# Altium project Node.PrjPCB (part 3 of 3)
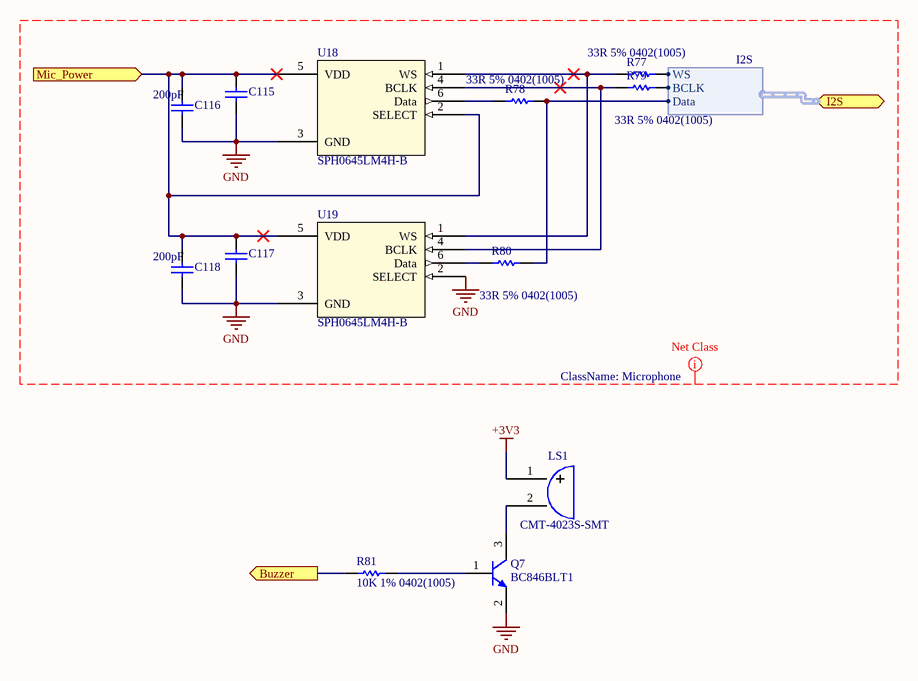
[diagram p11: Audio.SchDoc]

## Nets that join several sheets
+3V3: NFC (U40.16 U40.18), Interface (18 pins), LevelShifter (Q5.1 Q6.1 R72.2 R74.2), IR (11 pins), LEDs (21 pins), Power (FB1.2), RF (16 pins), uC (20 pins), Sensors (26 pins), Audio (LS1.1)
+5: NFC (C93.2 C94.2 U40.2), Interface (5 pins), LevelShifter (R73.2 R75.2), Power (C16.2 FB2.1 U6.14)
GND: NFC (30 pins), Interface (51 pins), IR (23 pins), LEDs (21 pins), Power (38 pins), RF (30 pins), uC (28 pins), Sensors (24 pins), Audio (8 pins)
VBUS: Interface (C4.1 F2.2 U3.31 U4.6), Power (Q4.3 R42.2)
VBUS2: Interface (F1.2 U1.6), Power (Q2.3 R26.2), uC (U17.M4)
VExt: Interface (P11.1), Power (Q3.3 R31.2)
VOut: IR (U8#1.4), Power (16 pins)
16U2 RX: Interface (U3.8), LevelShifter (Q6.3 R75.1)
16U2 TX: Interface (U3.9), LevelShifter (Q5.3 R73.1)
CE: Power (U5.17), uC (U17.L6)
MISO: NFC (U40.23), Interface (J4.7), uC (U17.B12)
MOSI: NFC (U40.24), Interface (J4.3), uC (U17.B11)
NetC7_2: Interface (C7.2), uC (U17.B3)
NetC12_1: Interface (C12.1 R15.2), uC (U17.L10)
NetC38_2: Interface (P1.10 R7.1), RF (C38.2 CC1.35 R47.1)
NetC56_1: uC (U17.L12), Sensors (C56.1 R52.2)
NetC60_1: uC (U17.F2), Sensors (C60.1 R54.2)
NetC64_1: uC (U17.F1), Sensors (C64.1 R58.2)
NetC115_2: uC (U17.C12), Audio (7 pins)
NetCC1_24: Interface (P1.2 R1.1), RF (CC1.24)
NetCC1_25: Interface (P1.4 R3.1), RF (CC1.25)
NetCC1_26: Interface (P1.6), RF (CC1.26)
NetCC1_27: Interface (P1.8 R5.1), RF (CC1.27)
NetCC1_41: RF (CC1.41), uC (U17.D3)
NetCC1_42: RF (CC1.42), uC (U17.B1)
NetJ1_2: RF (J1.2), uC (U17.C2)
NetJ1_3: RF (J1.3), uC (U17.C1)
NetJ1_5: RF (J1.5), uC (U17.D5)
NetJ1_9: RF (J1.9), uC (U17.D4)
NetJ4_2: Interface (J4.2), uC (U17.E3)
NetJ7_8: RF (J7.8), uC (U17.K11)
NetP2_4: Interface (P2.4 R4.1), uC (U17.H3)
NetP2_6: Interface (P2.6), uC (U17.H2)
NetP2_8: Interface (P2.8 R6.1), uC (U17.H4)
NetQ1_3: Interface (Q1.3 SW2.1), uC (U17.B6)
NetQ8_1: IR (Q8.1), uC (U17.E10)
NetR51_1: uC (U17.E1), Sensors (R51.1 U13.C2)
NetR67_2: IR (R92.2), uC (R67.2)
NetR77_2: uC (U17.F12), Audio (R77.2)
NetR78_2: uC (U17.G12), Audio (R78.2 R80.2)
NetR79_2: uC (U17.E11), Audio (R79.2)
NetR95_1: LEDs (R95.1), uC (U17.C10)
NetU12_4: uC (U17.B2), Sensors (U12.4)
NetU15_12: uC (U17.K10), Sensors (U15.12)
NetU17_A2: IR (U24.3), uC (U17.A2)
NetU17_A4: NFC (U40.12), uC (U17.A4)
NetU17_A5: NFC (U40.20), uC (U17.A5)
NetU17_A6: NFC (U40.21), uC (U17.A6)
NetU17_A11: IR (U20.3), uC (U17.A11)
NetU17_B5: NFC (U40.19), uC (U17.B5)
NetU17_C5: NFC (U40.28), uC (U17.C5)
NetU17_C6: NFC (U40.25), uC (U17.C6)
NetU17_C7: NFC (U40.14), uC (U17.C7)
NetU17_C8: NFC (U40.13), uC (U17.C8)
NetU17_C11: IR (U27.3), uC (U17.C11)
NetU17_D6: NFC (U40.27), uC (U17.D6)
NetU17_K7: IR (U28.3), uC (U17.K7)
NetU17_M9: IR (U23.3), uC (U17.M9)
PROG2: Power (U5.4), uC (U17.L8)
Reset: Interface (C1.2 P2.10 R8.1 R12.2), uC (U17.K4)
SAM_RX: LevelShifter (Q5.2 R72.1), uC (U17.G3)
SAM_TX: LevelShifter (Q6.2 R74.1), uC (U17.A1)
SCL: Interface (U2.2), Power (U6.2), uC (R62.1 U17.G11), Sensors (U12.1 U13.B3 U14.4 U16.4)
SCL: uC (R64.1 U17.K9), Sensors (U15.23)
SDA: Interface (U2.3), Power (U6.3), uC (R63.1 U17.H11), Sensors (U12.2 U13.C3 U14.3 U16.1)
SDA: uC (R65.1 U17.D1), Sensors (U15.24)
SEL: Power (U5.3), uC (U17.L7)
SPCK: NFC (U40.26), Interface (J4.5), uC (U17.A12)
~{TE}: Power (U5.9), uC (U17.L9)
TMS: Interface (P2.2 R2.1), uC (U17.J4)
USB_1_N: Interface (U1.7), uC (R68.2 U17.L2)
USB_1_P: Interface (U1.8), uC (R61.2 U17.L1)